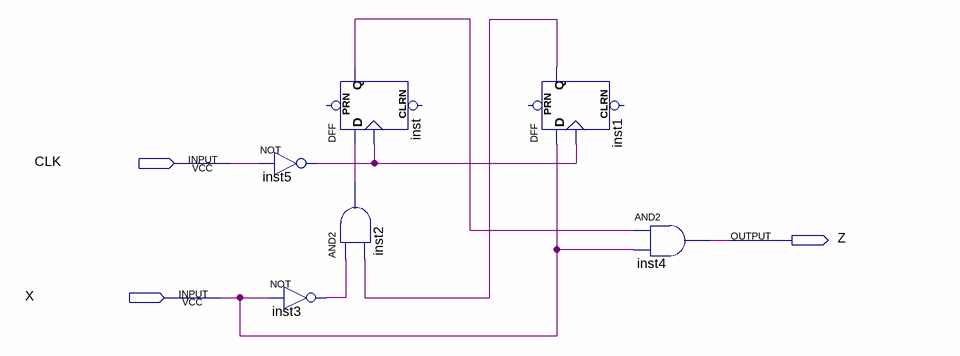
[diagram p0: schematic sheet]
// Quartus schematic Detector.bdf as structural Verilog: 6 symbols, 3 pins
module Detector (
  input  CLK,
  input  X,
  output Z
);

  wire inst1_q, inst2_out, inst3_out, inst5_out, inst_q;

  not inst5 (inst5_out, CLK);
  DFF inst (.CLK(inst5_out), .D(inst2_out), .Q(inst_q));  // open: CLRN, PRN
  and inst2 (inst2_out, inst3_out, inst1_q);
  not inst3 (inst3_out, X);
  DFF inst1 (.CLK(inst5_out), .D(X), .Q(inst1_q));  // open: CLRN, PRN
  and inst4 (Z, inst_q, X);
endmodule
